# Altium project Project_2.PrjPCB
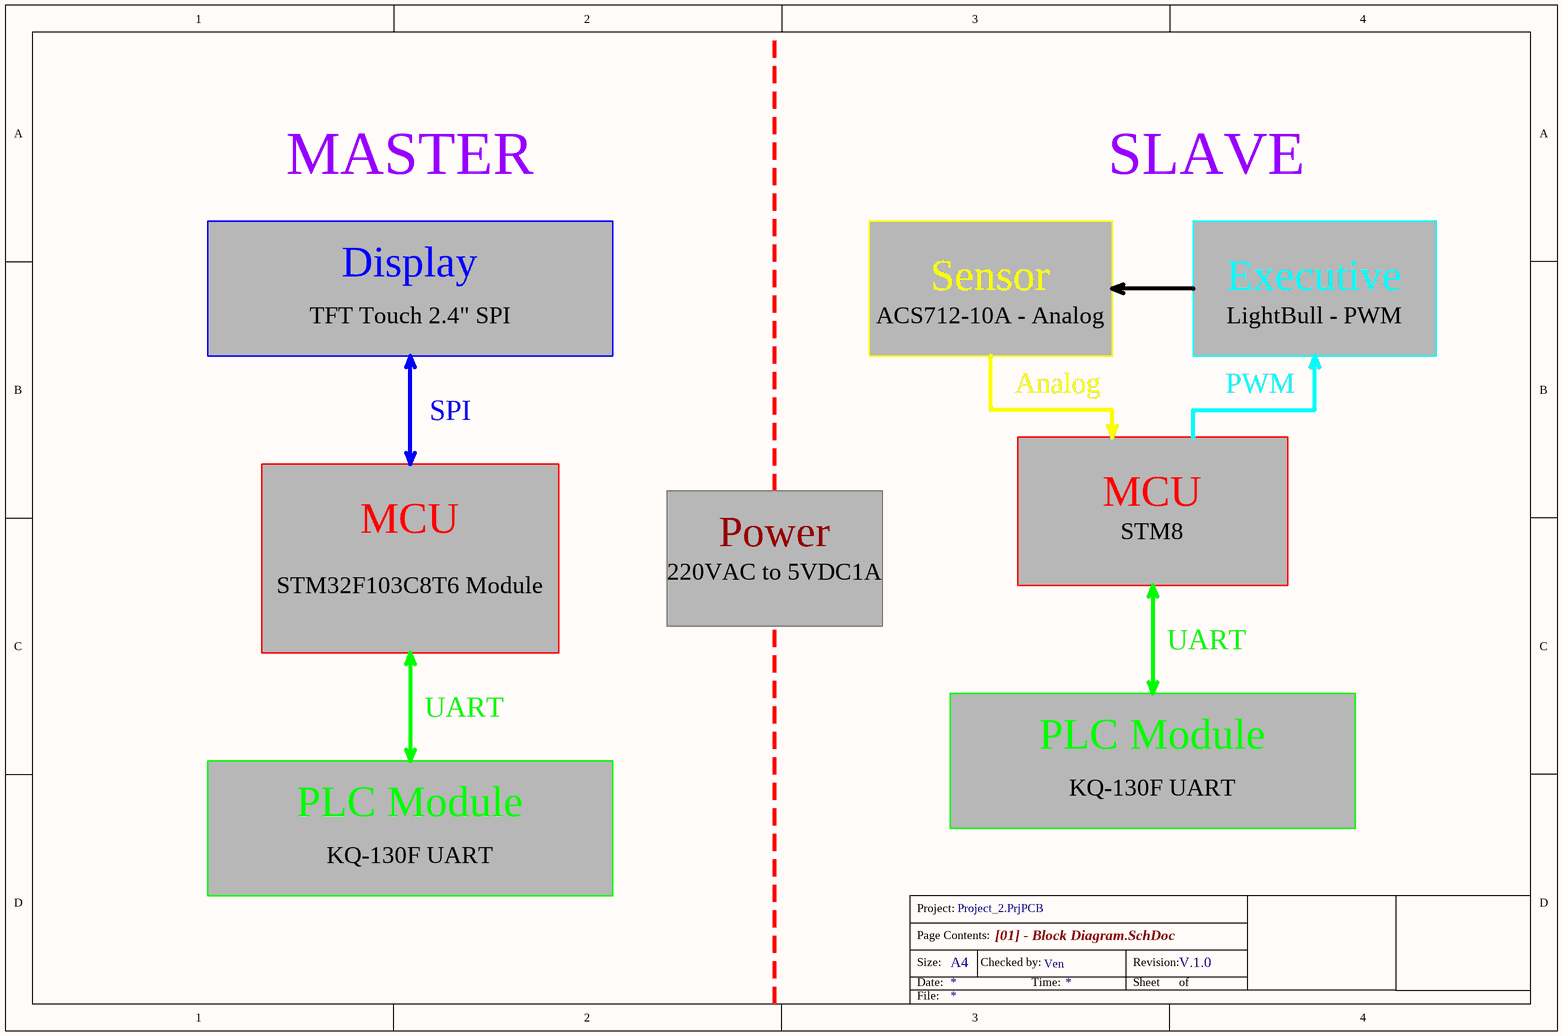
[diagram p0: [01] - Block Diagram.SchDoc]
10 sheets, 121 parts. Net scope: hierarchical (ports join the sheet entries above them; power ports are global).
Board files: Project_2_Master_PCB.PcbDoc, Project_2_Slave_PCB.PcbDoc, Project_2_Master_PCB_V1_1.PcbDoc, Project_2_Slave_PCB_V1_1.PcbDoc, Project_2_Slave_PCB_V1_2.PcbDoc
Sheets:
  [01] - Block Diagram.SchDoc
  [02] - Sheet Connector.SchDoc
    1 = [03] - Master_MCU.SchDoc
    3 = [05] - Master_Display.SchDoc
    5 = [07] - Slave_MCU.SchDoc
    8 = [10] - Slave_PLCModule.SchDoc
    7 = [09] - Slave_Sensor & Output.SchDoc
    2 = [04] - Master_Power.SchDoc
    6 = [08] - Slave_Power.SchDoc
    4 = [06] - Master_PLCModule.SchDoc

## Sheet [01] - Block Diagram.SchDoc: =ProjectName
size A4; CheckedBy: Ven; Author: Ven; CompanyName: HUST; Revision: V.1.0

### Notes on the sheet
- MASTER
- SLAVE
- Display
- TFT Touch 2.4" SPI
- Sensor
- ACS712-10A - Analog
- Executive
- LightBull - PWM
- Analog
- PWM
- SPI
- MCU
- STM32F103C8T6 Module
- Power
- 220VAC to 5VDC1A
- STM8
- UART
- PLC Module
- KQ-130F UART
- Project:
- Page Contents:
- Size:
- Date:
- A4
- Checked by:
- Time:
- Revision:
- Sheet
- of
- File:

## Sheet [02] - Sheet Connector.SchDoc: =ProjectName
size A4; CheckedBy: Ven; Author: Ven; CompanyName: HUST; Revision: V.1.0
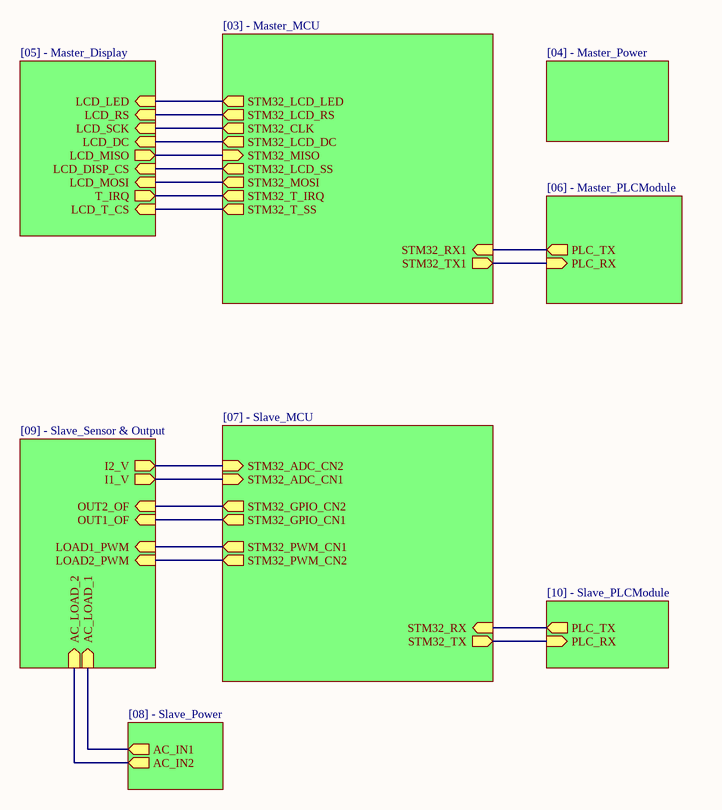
[diagram p1: [02] - Sheet Connector.SchDoc]

### Sub-sheets
1 = [03] - Master_MCU: STM32_LCD_LED (out), STM32_LCD_RS (out), STM32_CLK (out), STM32_LCD_DC (out), STM32_MISO (in), STM32_LCD_SS (out), STM32_MOSI (out), STM32_TX1 (out), STM32_T_IRQ (out), STM32_RX1 (in), STM32_T_SS (out)
2 = [04] - Master_Power: no entries
3 = [05] - Master_Display: LCD_MISO (out), T_IRQ (out), LCD_DC (in), LCD_SCK (in), LCD_LED (in), LCD_RS (in), LCD_MOSI (in), LCD_T_CS (in), LCD_DISP_CS (in)
4 = [06] - Master_PLCModule: PLC_TX (out), PLC_RX (in)
5 = [07] - Slave_MCU: STM32_ADC_CN1 (in), STM32_PWM_CN2 (out), STM32_ADC_CN2 (in), STM32_RX (in), STM32_GPIO_CN1 (out), STM32_GPIO_CN2 (out), STM32_TX (out), STM32_PWM_CN1 (out)
6 = [08] - Slave_Power: AC_IN2 (out), AC_IN1 (out)
7 = [09] - Slave_Sensor & Output: AC_LOAD_2 (in), I1_V (out), LOAD2_PWM (in), I2_V (out), AC_LOAD_1 (in), LOAD1_PWM (in), OUT2_OF (in), OUT1_OF (in)
8 = [10] - Slave_PLCModule: PLC_TX (out), PLC_RX (in)

### Nets
AC1: sheet 7/AC_LOAD_1, sheet 6/AC_IN1
AC2: sheet 7/AC_LOAD_2, sheet 6/AC_IN2
CS: sheet 1/STM32_LCD_SS, sheet 3/LCD_DISP_CS
DC: sheet 1/STM32_LCD_DC, sheet 3/LCD_DC
LED: sheet 1/STM32_LCD_LED, sheet 3/LCD_LED
MISO: sheet 1/STM32_MISO, sheet 3/LCD_MISO
MOSI: sheet 1/STM32_MOSI, sheet 3/LCD_MOSI
RS: sheet 1/STM32_LCD_RS, sheet 3/LCD_RS
SCK: sheet 1/STM32_CLK, sheet 3/LCD_SCK
T_CS: sheet 1/STM32_T_SS, sheet 3/LCD_T_CS
T_IQR: sheet 1/STM32_T_IRQ, sheet 3/T_IRQ
NetIC5_7: sheet 5/STM32_ADC_CN1, sheet 7/I1_V
NetIC6_7: sheet 5/STM32_ADC_CN2, sheet 7/I2_V
NetJP3_4: sheet 1/STM32_TX1, sheet 4/PLC_RX
NetJP3_5: sheet 1/STM32_RX1, sheet 4/PLC_TX
NetJP4_4: sheet 5/STM32_TX, sheet 8/PLC_RX
NetJP4_5: sheet 5/STM32_RX, sheet 8/PLC_TX
NetR20_2: sheet 5/STM32_PWM_CN1, sheet 7/LOAD1_PWM
NetR21_2: sheet 5/STM32_GPIO_CN1, sheet 7/OUT1_OF
NetR24_2: sheet 5/STM32_GPIO_CN2, sheet 7/OUT2_OF
NetR28_2: sheet 5/STM32_PWM_CN2, sheet 7/LOAD2_PWM

### Notes on the sheet
- Project:
- Page Contents:
- Size:
- Date:
- A4
- Checked by:
- Time:
- Revision:
- Sheet
- of
- File:

## Sheet [03] - Master_MCU.SchDoc: =ProjectName
size A4; CheckedBy: Ven; Author: Ven; CompanyName: HUST; Revision: V.1.0
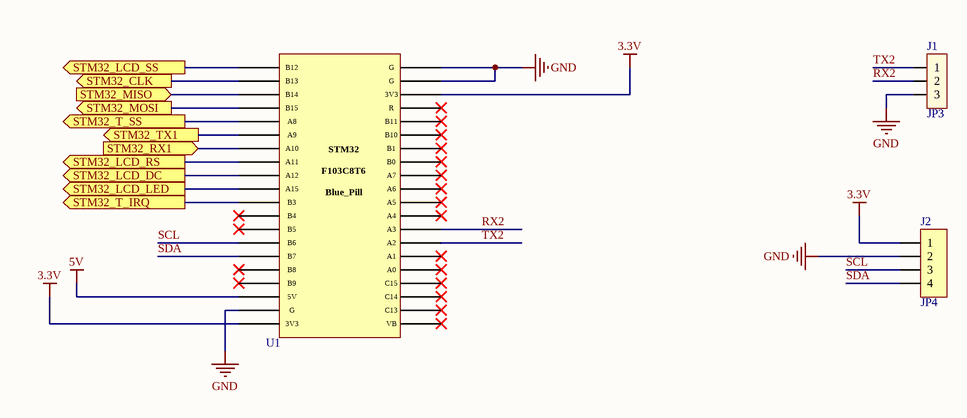
[diagram p2: [03] - Master_MCU.SchDoc]

### Parts
J1  JP3  [JP3]
J2  JP4  [J4-D1T]
U1  STM32 Bluepill  [Blue_Pill_Board]  (value not drawn)

### Ports
STM32_CLK (out), STM32_LCD_DC (out), STM32_LCD_LED (out), STM32_LCD_RS (out), STM32_LCD_SS (out), STM32_MISO (in), STM32_MOSI (out), STM32_RX1 (in), STM32_T_IRQ (out), STM32_T_SS (out), STM32_TX1 (out)

### Nets
3.3V: J2.1 U1.20(3V3) U1.23(3V3)
5V: U1.18(5V)
GND: J1.3 J2.2 U1.19(G) U1.21(G) U1.22(G)
CS: U1.1(B12) ; port STM32_LCD_SS
DC: U1.9(A12) ; port STM32_LCD_DC
LED: U1.10(A15) ; port STM32_LCD_LED
MISO: U1.3(B14) ; port STM32_MISO
MOSI: U1.4(B15) ; port STM32_MOSI
RS: U1.8(A11) ; port STM32_LCD_RS
RX2: J1.2 U1.33(A3)
SCK: U1.2(B13) ; port STM32_CLK
SCL: J2.3 U1.14(B6)
SDA: J2.4 U1.15(B7)
T_CS: U1.5(A8) ; port STM32_T_SS
T_IQR: U1.11(B3) ; port STM32_T_IRQ
TX2: J1.1 U1.34(A2)
NetJP3_4: U1.6(A9) ; port STM32_TX1
NetJP3_5: U1.7(A10) ; port STM32_RX1

Not connected (* = marked no-connect by the designer): U1 12(B4)* 13(B5)* 16(B8)* 17(B9)* 24(R)* 25(B11)* 26(B10)* 27(B1)* 28(B0)* 29(A7)* 30(A6)* 31(A5)* 32(A4)* 35(A1)* 36(A0)* 37(C15)* 38(C14)* 39(C13)* 40(VB)*

### Notes on the sheet
- Project:
- Page Contents:
- Size:
- Date:
- A4
- Checked by:
- Time:
- Revision:
- Sheet
- of
- File:
- (in symbol STM32 Bluepill) / STM32 / F103C8T6 / Blue_Pill

### Library data of the parts
J1 = JP3: UART2; Value: J3
J2 = JP4x1-2.0: I2C; Manufacturer: W¨¹rth Elektronik eiSos GmbH; partNo: 62000411821; ComponentLink1 Description: Manufacturer; ComponentLink2 Description: Datasheet; NoPins: 04; Created Date: 2 April 2013; ComponentLink1URL: http://www.we-online.com; ComponentLink2URL: http://katalog.we-online.de/em/datasheet/6200xx11821.pdf; Created by: Karrer Zheng
U1 = STM32 Bluepill: STM32 Bluepill Kit

## Sheet [05] - Master_Display.SchDoc: =ProjectName
size A4; CheckedBy: Ven; Author: Ven; CompanyName: HUST; Revision: V.1.0
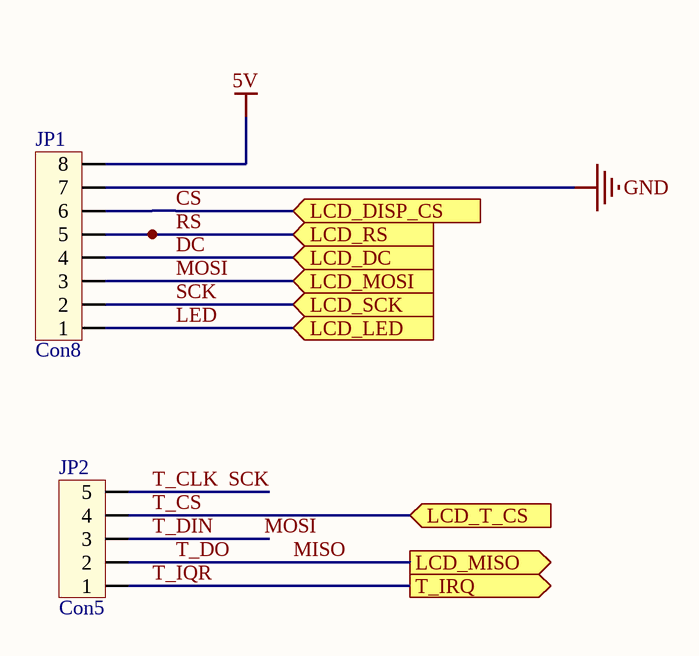
[diagram p3: [05] - Master_Display.SchDoc]

### Parts
JP1  Con8  [CON8]
JP2  Con5  [CON5]

### Ports
LCD_DC (in), LCD_DISP_CS (in), LCD_LED (in), LCD_MISO (out), LCD_MOSI (in), LCD_RS (in), LCD_SCK (in), LCD_T_CS (in), T_IRQ (out)

### Nets
5V: JP1.8
GND: JP1.7
CS: JP1.6 ; port LCD_DISP_CS
DC: JP1.4 ; port LCD_DC
LED: JP1.1 ; port LCD_LED
MISO: JP2.2 ; port LCD_MISO  [also labelled T_DO]
MOSI: JP1.3 JP2.3 ; port LCD_MOSI  [also labelled T_DIN]
RS: JP1.5 ; port LCD_RS
SCK: JP1.2 JP2.5 ; port LCD_SCK  [also labelled T_CLK]
T_CS: JP2.4 ; port LCD_T_CS
T_IQR: JP2.1 ; port T_IRQ

### Notes on the sheet
- Project:
- Page Contents:
- Size:
- Date:
- A4
- Checked by:
- Time:
- Revision:
- Sheet
- of
- File:

### Library data of the parts
JP1 = Con8: DISPLAY; Value: Connector 8
JP2 = Con5: TOUCH; Value: Connector 5

## Sheet [07] - Slave_MCU.SchDoc: =ProjectName
size A4; CheckedBy: Ven; Author: Ven; CompanyName: HUST; Revision: V.1.0
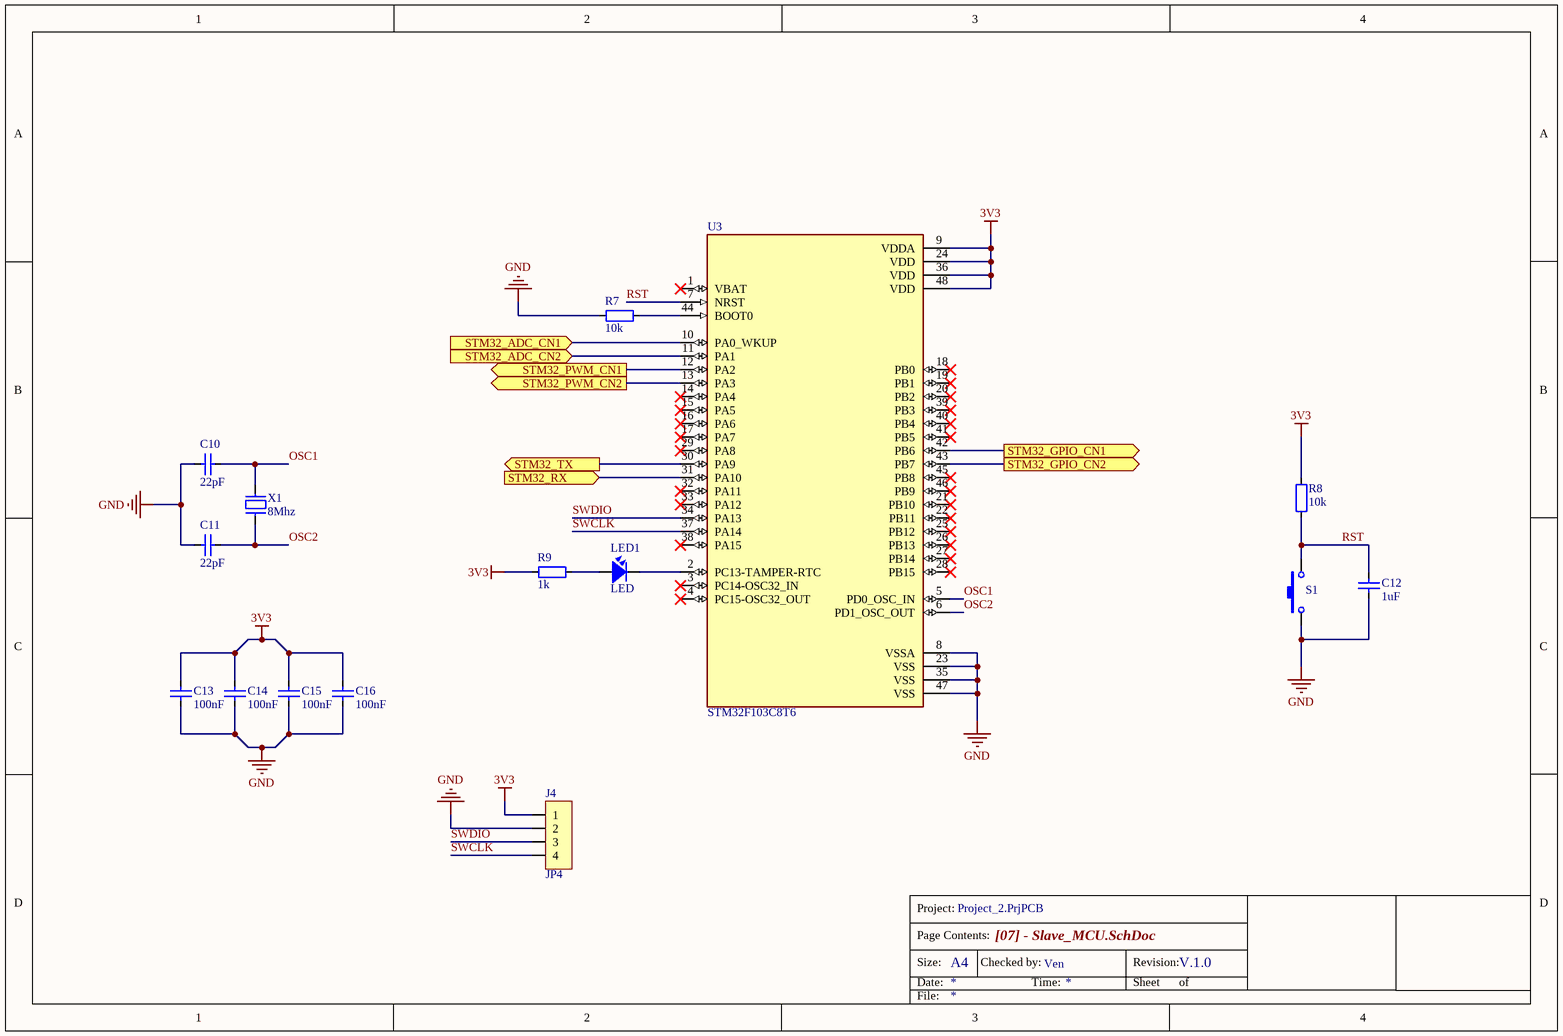
[diagram p4: [07] - Slave_MCU.SchDoc]

### Parts
C10  22pF  [CAP_0805]
C11  22pF  [CAP_0805]
C12  1uF  [CAP_0805]
C13  100nF  [CAP_0805]
C14  100nF  [CAP_0805]
C15  100nF  [CAP_0805]
C16  100nF  [CAP_0805]
J4  JP4  [JP4-C1T]
LED1  LED  [LED-0805-Blue]
R7  10k  [RES-SMD-0805]
R8  10k  [RES-SMD-0805]
R9  1k  [RES-SMD-0805]
S1  SW-SMD  [SW 3x2x4]  (value not drawn)
U3  STM32F103C8T6  [LQFP 48]
X1  8Mhz  [XTAL 5032 SMD]

### Ports
STM32_ADC_CN1 (in), STM32_ADC_CN2 (in), STM32_GPIO_CN1 (out), STM32_GPIO_CN2 (out), STM32_PWM_CN1 (out), STM32_PWM_CN2 (out), STM32_RX (in), STM32_TX (out)

### Nets
3V3: C13.2 C14.2 C15.2 C16.2 J4.1 R8.2 R9.2 U3.9(VDDA) U3.24(VDD) U3.36(VDD) U3.48(VDD)
GND: C10.2 C11.2 C12.1 C13.1 C14.1 C15.1 C16.1 J4.2 R7.2 S1.1 U3.8(VSSA) U3.23(VSS) U3.35(VSS) U3.47(VSS)
OSC1: C10.1 U3.5(PD0_OSC_IN) X1.2
OSC2: C11.1 U3.6(PD1_OSC_OUT) X1.1
RST: C12.2 R8.1 S1.2 U3.7(NRST)
SWCLK: J4.4 U3.37(PA14)
SWDIO: J4.3 U3.34(PA13)
NetIC5_7: U3.10(PA0_WKUP) ; port STM32_ADC_CN1
NetIC6_7: U3.11(PA1) ; port STM32_ADC_CN2
NetJP4_4: U3.30(PA9) ; port STM32_TX
NetJP4_5: U3.31(PA10) ; port STM32_RX
NetLED1_1: LED1.1 R9.1
NetLED1_2: LED1.2 U3.2(PC13-TAMPER-RTC)
NetR7_1: R7.1 U3.44(BOOT0)
NetR20_2: U3.12(PA2) ; port STM32_PWM_CN1
NetR21_2: U3.42(PB6) ; port STM32_GPIO_CN1
NetR24_2: U3.43(PB7) ; port STM32_GPIO_CN2
NetR28_2: U3.13(PA3) ; port STM32_PWM_CN2

Not connected (* = marked no-connect by the designer): U3 1(VBAT)* 3(PC14-OSC32_IN)* 4(PC15-OSC32_OUT)* 14(PA4)* 15(PA5)* 16(PA6)* 17(PA7)* 18(PB0)* 19(PB1)* 20(PB2)* 21(PB10)* 22(PB11)* 25(PB12)* 26(PB13)* 27(PB14)* 28(PB15)* 29(PA8)* 32(PA11)* 33(PA12)* 38(PA15)* 39(PB3)* 40(PB4)* 41(PB5)* 45(PB8)* 46(PB9)*

### Notes on the sheet
- Project:
- Page Contents:
- Size:
- Date:
- A4
- Checked by:
- Time:
- Revision:
- Sheet
- of
- File:

### Library data of the parts
C10-C16 = CapSMD: Capacitor; Value: 33p; Published: 8-Jun-2000; LatestRevisionDate: 17-Jul-2002; LatestRevisionNote: Re-released for DXP Platform.; PackageReference: RAD-0.3; Publisher: Altium Limited
J4 = JP4: WR-PHD 2.54 mm Angled Socket Header; Manufacturer: W¨¹rth Elektronik eiSos GmbH; partNo: 613004143121; ComponentLink1 Description: Manufacturer; ComponentLink2 Description: Datasheet; NoPins: 04; Created Date: 29 March 2013; ComponentLink1URL: http://www.we-online.com; ComponentLink2URL: http://katalog.we-online.de/em/datasheet/6130xx143121.pdf; Created by: Karrer Zheng
LED1 = LED: LED Single colour Green and Red; Value: LED 3 ly Single Colour
R7-R9 = Resistor - SMD: Resistor; Manufacturer: Generic Components; Class: Passive; Published: 08/06/2000; Publisher: Altium Hobart Technology Centre
S1 = SW-SMD: Switch; Published: 24-Mar-1999; LatestRevisionDate: 17-Jul-2002; LatestRevisionNote: Re-released for DXP Platform.; PackageReference: SPST-2; Publisher: Altium Limited
X1 = XT2: Crystal For all Crystal 2pin.; Value: 4Mhz

## Sheet [10] - Slave_PLCModule.SchDoc: =ProjectName
size A4; CheckedBy: Ven; Author: Ven; CompanyName: HUST; Revision: V.1.0
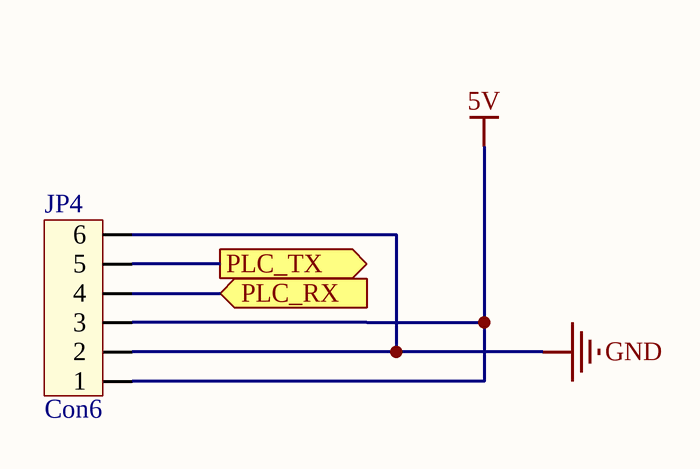
[diagram p5: [10] - Slave_PLCModule.SchDoc]

### Parts
JP4  Con6  [CON6]

### Ports
PLC_RX (in), PLC_TX (out)

### Nets
5V: JP4.1 JP4.3
GND: JP4.2 JP4.6
NetJP4_4: JP4.4 ; port PLC_RX
NetJP4_5: JP4.5 ; port PLC_TX

### Notes on the sheet
- Project:
- Page Contents:
- Size:
- Date:
- A4
- Checked by:
- Time:
- Revision:
- Sheet
- of
- File:

### Library data of the parts
JP4 = Con6: PLC module; Value: Connector 6

## Sheet [09] - Slave_Sensor & Output.SchDoc: =ProjectName
size A4; CheckedBy: DatNB; Author: Ven; CompanyName: Nacentech; Organization: IMET
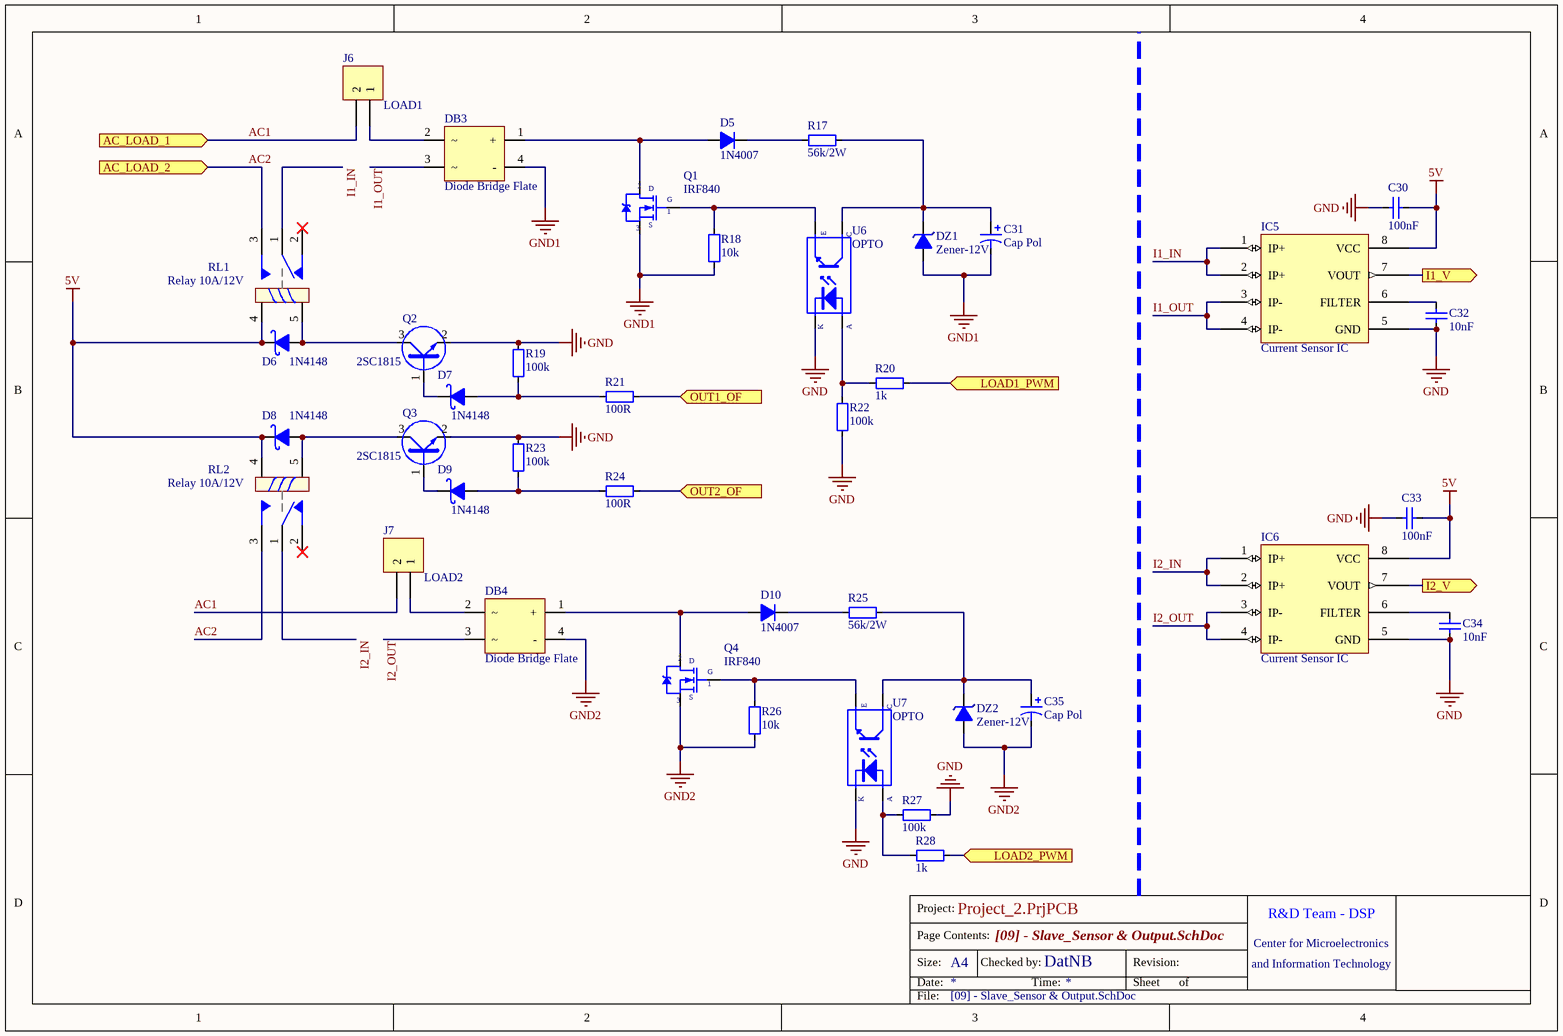
[diagram p6: [09] - Slave_Sensor & Output.SchDoc]

### Parts
C30  100nF  [CAP_0805]
C31  Cap Pol  [C5mm]
C32  10nF  [CAP_0805]
C33  100nF  [CAP_0805]
C34  10nF  [CAP_0805]
C35  Cap Pol  [C5mm]
D5  1N4007  [D2A]
D6  1N4148  [1N4148_SMD]
D7  1N4148  [1N4148_SMD]
D8  1N4148  [1N4148_SMD]
D9  1N4148  [1N4148_SMD]
D10  1N4007  [D2A]
DB3  Diode Bridge Flate  [DB207S]
DB4  Diode Bridge Flate  [DB207S]
DZ1  Zener-12V  [D1A]
DZ2  Zener-12V  [D1A]
IC5  Current Sensor IC  [SOIC-8]
IC6  Current Sensor IC  [SOIC-8]
J6  LOAD1  [KF2-5.08T]
J7  LOAD2  [KF2-5.08T]
Q1  IRF840  [QTO-220H3]
Q2  2SC1815  [SOT23D]
Q3  2SC1815  [SOT23D]
Q4  IRF840  [QTO-220H3]
R17  56k/2W  [RES-2W]
R18  10k  [RES-SMD-0805]
R19  100k  [RES-SMD-0805]
R20  1k  [RES-SMD-0805]
R21  100R  [RES-SMD-0805]
R22  100k  [RES-SMD-0805]
R23  100k  [RES-SMD-0805]
R24  100R  [RES-SMD-0805]
R25  56k/2W  [RES-2W]
R26  10k  [RES-SMD-0805]
R27  100k  [RES-SMD-0805]
R28  1k  [RES-SMD-0805]
RL1  Relay 10A/12V  [RL_SPDT_10A]
RL2  Relay 10A/12V  [RL_SPDT_10A]
U6  OPTO  [OPTO]
U7  OPTO  [OPTO]

### Ports
AC_LOAD_1 (in), AC_LOAD_2 (in), I1_V (out), I2_V (out), LOAD1_PWM (in), LOAD2_PWM (in), OUT1_OF (in), OUT2_OF (in)

### Nets
5V: C30.1 C33.1 D6.2(K) D8.2(K) IC5.8(VCC) IC6.8(VCC) RL1.4 RL2.4
GND: C30.2 C32.1 C33.2 C34.1 IC5.5(GND) IC6.5(GND) Q2.2(E) Q3.2(E) R19.2 R22.1 R23.2 R27.1 U6.K U7.K
GND1: C31.2 DB3.4(-) DZ1.1(A) Q1.3(S) R18.1
GND2: C35.2 DB4.4(-) DZ2.1(A) Q4.3(S) R26.1
AC1: J6.2 J7.2 ; port AC_LOAD_1
AC2: RL1.3 RL2.3 ; port AC_LOAD_2
I1_IN: IC5.1(IP+) IC5.2(IP+) RL1.1
I1_OUT: DB3.3 IC5.3(IP-) IC5.4(IP-)
I2_IN: IC6.1(IP+) IC6.2(IP+) RL2.1
I2_OUT: DB4.3 IC6.3(IP-) IC6.4(IP-)
NetC31_1: C31.1 DZ1.2(K) R17.2 U6.C
NetC32_2: C32.2 IC5.6(FILTER)
NetC34_2: C34.2 IC6.6(FILTER)
NetC35_1: C35.1 DZ2.2(K) R25.2 U7.C
NetD5_1: D5.1(A) DB3.1(+) Q1.2(D)
NetD5_2: D5.2(K) R17.1
NetD6_1: D6.1(A) Q2.3(C) RL1.5
NetD7_1: D7.1(A) R19.1 R21.1
NetD7_2: D7.2(K) Q2.1(B)
NetD8_1: D8.1(A) Q3.3(C) RL2.5
NetD9_1: D9.1(A) R23.1 R24.1
NetD9_2: D9.2(K) Q3.1(B)
NetD10_1: D10.1(A) DB4.1(+) Q4.2(D)
NetD10_2: D10.2(K) R25.1
NetDB3_2: DB3.2 J6.1
NetDB4_2: DB4.2 J7.1
NetIC5_7: IC5.7(VOUT) ; port I1_V
NetIC6_7: IC6.7(VOUT) ; port I2_V
NetQ1_1: Q1.1(G) R18.2 U6.E
NetQ4_1: Q4.1(G) R26.2 U7.E
NetR20_1: R20.1 R22.2 U6.A
NetR20_2: R20.2 ; port LOAD1_PWM
NetR21_2: R21.2 ; port OUT1_OF
NetR24_2: R24.2 ; port OUT2_OF
NetR27_2: R27.2 R28.1 U7.A
NetR28_2: R28.2 ; port LOAD2_PWM

Not connected (* = marked no-connect by the designer): RL1 2*; RL2 2*

### Notes on the sheet
- Project:
- R&D Team - DSP
- Page Contents:
- Size:
- Date:
- A4
- Checked by:
- Time:
- Revision:
- Sheet
- of
- Center for Microelectronics
- and Information Technology
- File:

### Library data of the parts
C30 C32-C34 = CapSMD: Capacitor; Value: 33p; Published: 8-Jun-2000; LatestRevisionDate: 17-Jul-2002; LatestRevisionNote: Re-released for DXP Platform.; PackageReference: RAD-0.3; Publisher: Altium Limited
C31 C35 = Cap Pol: Polarized Capacitor (Axial); Published: 8-Jun-2000; LatestRevisionDate: 17-Jul-2002; LatestRevisionNote: Re-released for DXP Platform.; PackageReference: POLAR0.8; Publisher: Altium Limited
D5 D10 = D1A: Diode 1A; Value: 1N4007
D6-D9 = 1N5822: Schottky Rectifiers; Value: Diode c?m 1N5408
DB3 DB4 = Diode Bridge Flate: Diode Bridge
DZ1 DZ2 = Zener
IC5 IC6 = ACS712
J6 J7 = KF2: Manufacturer: Würth Elektronik eiSos GmbH; partNo: 691103110002; ComponentLink1 Description: Manufacturer; ComponentLink2 Description: Datasheet; NoPins: 2; Created Date: 29 October 2013; ComponentLink1URL: http://www.we-online.com; ComponentLink2URL: http://katalog.we-online.de/em/datasheet/6911031100xx.pdf; Created by: Karrer Zheng
Q1 Q4 = IRF840: MOSFET N - CHANNEL 500V - 0.75 - 8A - TO-220; Value: IRF840
Q2 Q3 = 2SC1815: NPN 600mW, ECB; Value: C1815
R17 R18 R25 R26 = Resistor - DIP: Value: R1/4W - 1K
R19-R24 R27 R28 = Resistor - SMD: as R7 on sheet [07] - Slave_MCU; Published: 08/06/2000; Publisher: Altium Hobart Technology Centre
RL1 RL2 = Relay 1: Relay SPDT,10A - 12VDC 5 Pin; Value: Relay SPDT, 10A, 12V
U6 U7 = OPTO: Single Opto; pin to pad: A>1 C>4 E>3 K>2; Value: TLP5211

## Sheet [04] - Master_Power.SchDoc: =ProjectName
size A4; CheckedBy: DatNB; Author: Ven; CompanyName: Nacentech; Organization: IMET
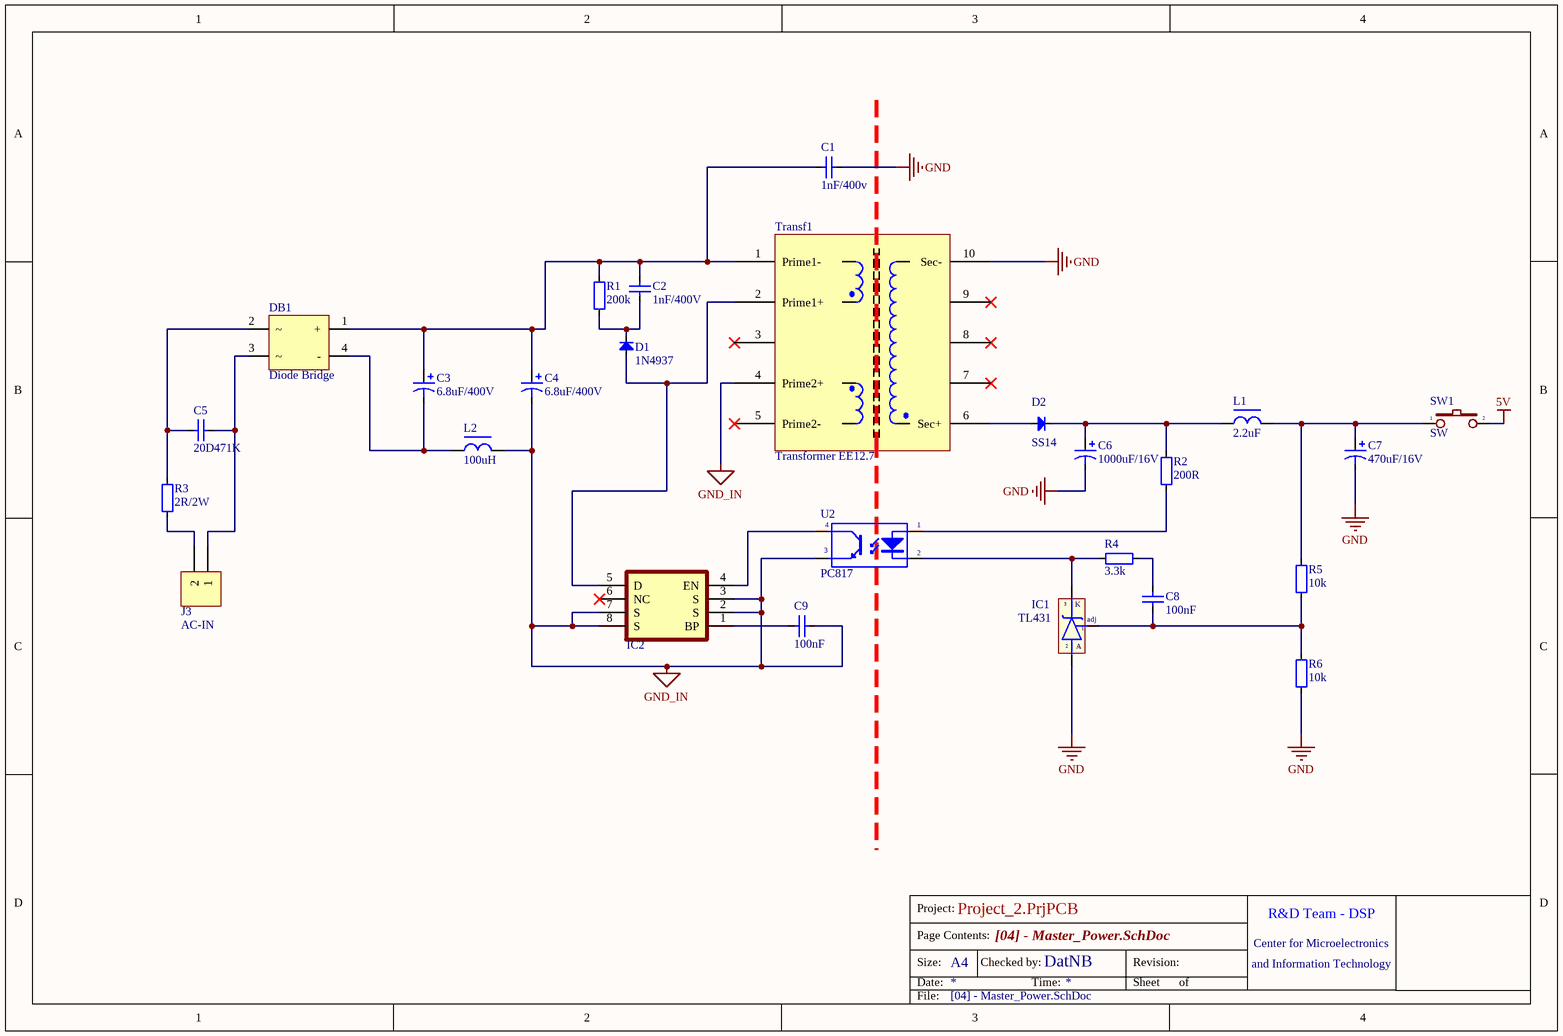
[diagram p7: [04] - Master_Power.SchDoc]

### Parts
C1  1nF/400v  [103/2KV]
C2  1nF/400V  [103/2KV]
C3  6.8uF/400V  [C8mm]
C4  6.8uF/400V  [C8mm]
C5  20D471K  [103/2KV]
C6  1000uF/16V  [C8mm]
C7  470uF/16V  [C8mm]
C8  100nF  [CAP_0805]
C9  100nF  [CAP_0805]
D1  1N4937  [DIO-1AN]
D2  SS14  [DO-214AC(SMA)]
DB1  Diode Bridge  [DB207S]
IC1  TL431  [qto-92]
IC2  TNY264  [DIP8]  (value not drawn)
J3  AC-IN  [KF2-5.08]
L1  2.2uF  [L-SMD-M-7.3x4.5]
L2  100uH  [L-DIP-M-9.5x6]
R1  200k  [RES-1/4WD]
R2  200R  [RES-SMD-0805]
R3  2R/2W  [RES-1WD]
R4  3.3k  [RES-SMD-0805]
R5  10k  [RES-SMD-0805]
R6  10k  [RES-SMD-0805]
SW1  SW  [SW2]
Transf1  Transformer EE12.7  [Transformer EE12.7]
U2  PC817  [DIP4/W0.3]

### Nets
5V: SW1.2
GND: C1.1 C6.2 C7.2 IC1.2(A) R6.2 Transf1.10(Sec-)
GND_IN: C4.2 C9.1 IC2.2(S) IC2.3(S) IC2.7(S) IC2.8(S) L2.2 Transf1.4(Prime2+) U2.3(E)
NetC1_2: C1.2 C2.1 C3.1 C4.1 DB1.1(+) R1.2 Transf1.1(Prime1-)
NetC2_2: C2.2 D1.2(K) R1.1
NetC3_2: C3.2 DB1.4(-) L2.1
NetC5_1: C5.1 DB1.3 J3.1
NetC5_2: C5.2 DB1.2 R3.1
NetC6_1: C6.1 D2.2(K) L1.1 R2.1
NetC7_1: C7.1 L1.2 R5.1 SW1.1
NetC8_1: C8.1 IC1.1(adj) R5.2 R6.1
NetC8_2: C8.2 R4.2
NetC9_2: C9.2 IC2.1(BP)
NetD1_1: D1.1(A) IC2.5(D) Transf1.2(Prime1+)
NetD2_1: D2.1(A) Transf1.6(Sec+)
NetIC1_3: IC1.3(K) R4.1 U2.2(K)
NetIC2_4: IC2.4(EN) U2.4(C)
NetJ3_2: J3.2 R3.2
NetR2_2: R2.2 U2.1(A)

Not connected (* = marked no-connect by the designer): IC2 6(NC)*; Transf1 3* 5(Prime2-)* 7* 8* 9*

### Notes on the sheet
- Project:
- R&D Team - DSP
- Page Contents:
- Size:
- Date:
- A4
- Checked by:
- Time:
- Revision:
- Sheet
- of
- Center for Microelectronics
- and Information Technology
- File:

### Library data of the parts
C1 C2 = Cap2KV: CAP CERAMIC; Published: 8-Jun-2000; LatestRevisionDate: 17-Jul-2002; LatestRevisionNote: Re-released for DXP Platform.; PackageReference: RAD-0.3; Publisher: Altium Limited
C3 C4 C6 C7 = Cap Pol: Polarized Capacitor (Axial); Published: 8-Jun-2000; LatestRevisionDate: 17-Jul-2002; LatestRevisionNote: Re-released for DXP Platform.; PackageReference: POLAR0.8; Publisher: Altium Limited
C5 = Cap2KV: Varistor; Published: 8-Jun-2000; LatestRevisionDate: 17-Jul-2002; LatestRevisionNote: Re-released for DXP Platform.; PackageReference: RAD-0.3; Publisher: Altium Limited
C8 C9 = CapSMD: Capacitor; Value: 33p; Published: 8-Jun-2000; LatestRevisionDate: 17-Jul-2002; LatestRevisionNote: Re-released for DXP Platform.; PackageReference: RAD-0.3; Publisher: Altium Limited
D1 = Diode SMD: Diode Schottky / 1N4937; Code - JEDEC: DO-214-AB; Value: 1N5007; Published: 8-Jun-2000; Revision: July-2002: Re-released for DXP Platform.; Publisher: Altium Limited
D2 = Diode SMD: Diode Schottky / 1N5819; Code - JEDEC: DO-214-AB; Value: 1N5007; Published: 8-Jun-2000; Revision: July-2002: Re-released for DXP Platform.; Publisher: Altium Limited
DB1 = Diode Bridge Flate
IC1 = TL431: Programmable Shunt Regulator; Value: TL431
IC2 = TNY264: Enhanced, Energy Efficient, Low Power Off-line Switcher
J3 = KF2: as J6 on sheet [09] - Slave_Sensor & Output; Created Date: 29 October 2013; ComponentLink1URL: http://www.we-online.com; ComponentLink2URL: http://katalog.we-online.de/em/datasheet/6911031100xx.pdf; Created by: Karrer Zheng
L1 L2 = L-DIP-1: Inductor; Value: 150 mH
R1-R6 = Resistor - SMD: as R7 on sheet [07] - Slave_MCU; Published: 08/06/2000; Publisher: Altium Hobart Technology Centre
SW1 = SW2: Switch button 2 pin; Value: SW chip 2 pin
Transf1 = Tranformer EE16
U2 = PC817: Single Opto; Value: PC817

## Sheet [08] - Slave_Power.SchDoc: =ProjectName
size A4; CheckedBy: DatNB; Author: Ven; CompanyName: Nacentech; Organization: IMET
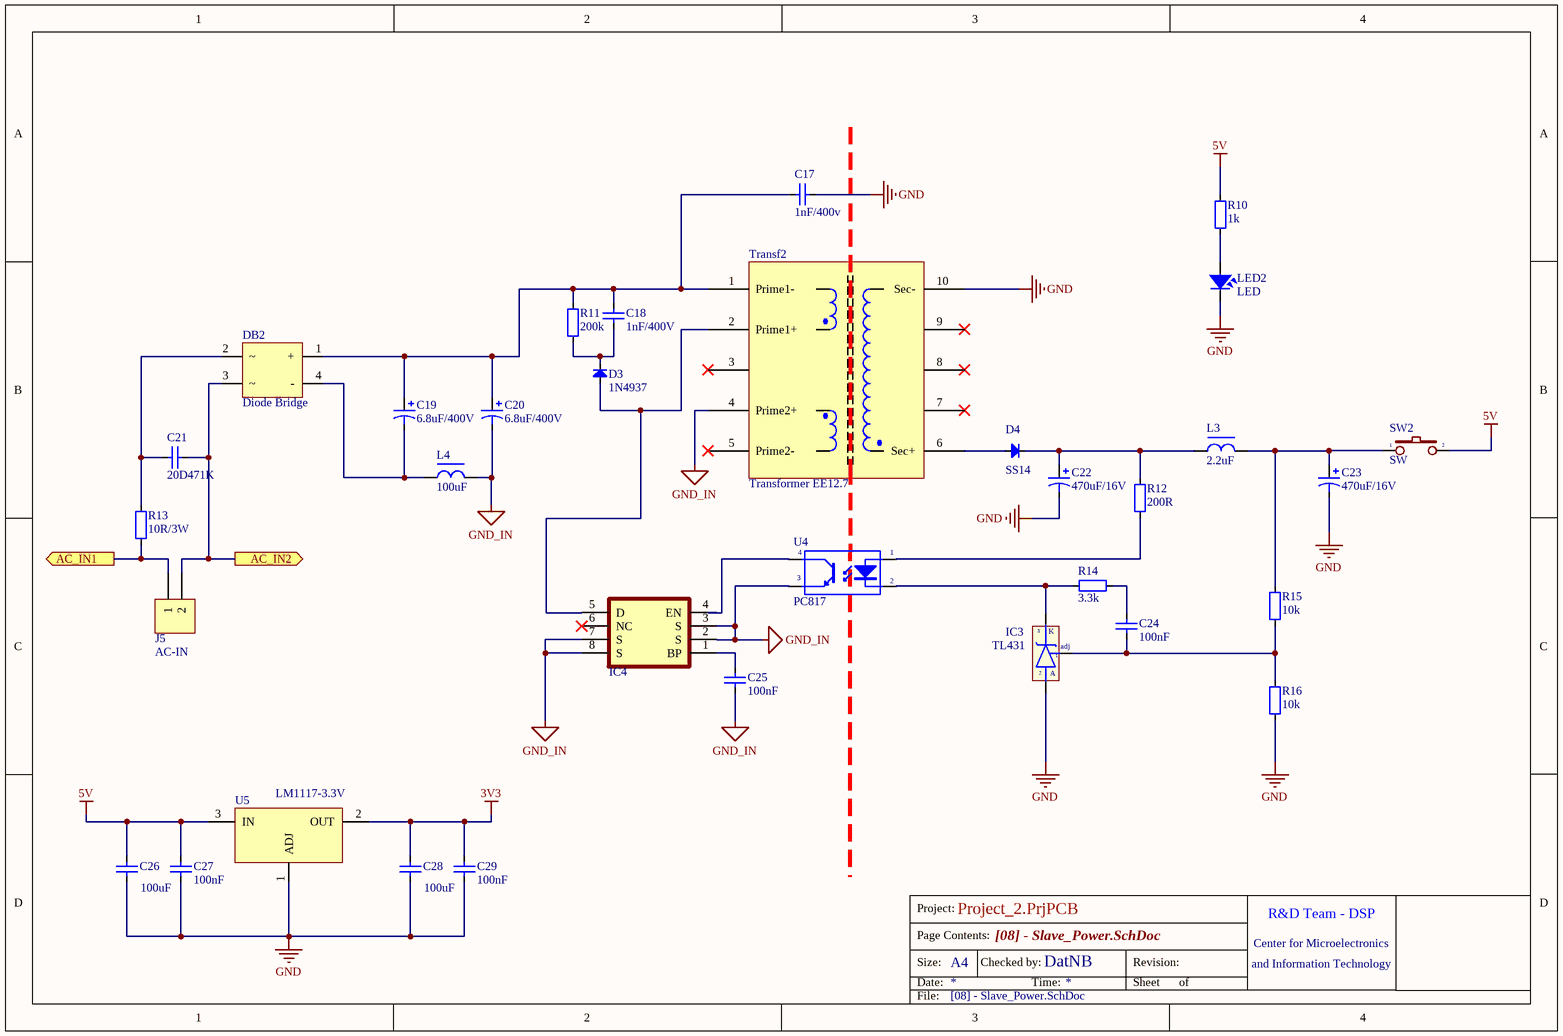
[diagram p8: [08] - Slave_Power.SchDoc]

### Parts
C17  1nF/400v  [103/2KV]
C18  1nF/400V  [103/2KV]
C19  6.8uF/400V  [C8mm]
C20  6.8uF/400V  [C8mm]
C21  20D471K  [103/2KV]
C22  470uF/16V  [C8mm]
C23  470uF/16V  [C8mm]
C24  100nF  [CAP_0805]
C25  100nF  [CAP_0805]
C26  100uF  [CAP_3216]
C27  100nF  [CAP_0805]
C28  100uF  [CAP_3216]
C29  100nF  [CAP_0805]
D3  1N4937  [DIO-1AN]
D4  SS14  [DO-214AC(SMA)]
DB2  Diode Bridge  [DB207S]
IC3  TL431  [qto-92]
IC4  TNY267  [DIP8]  (value not drawn)
J5  AC-IN  [KF2-5.08]
L3  2.2uF  [L-SMD-M-7.3x4.5]
L4  100uF  [L-DIP-M-9.5x6]
LED2  LED  [LED-0805-Red]
R10  1k  [RES-SMD-0805]
R11  200k  [RES-1/4WD]
R12  200R  [RES-SMD-0805]
R13  10R/3W  [RES-1WD]
R14  3.3k  [RES-SMD-0805]
R15  10k  [RES-SMD-0805]
R16  10k  [RES-SMD-0805]
SW2  SW  [SW2]
Transf2  Transformer EE12.7  [Transformer EE12.7]
U4  PC817  [DIP4/W0.3]
U5  LM1117-3.3V  [LM1117-SOP]

### Ports
AC_IN1 (out), AC_IN2 (out)

### Nets
3V3: C28.2 C29.2 U5.2(OUT)
5V: C26.2 C27.2 R10.2 SW2.2 U5.3(IN)
GND: C17.1 C22.2 C23.2 C26.1 C27.1 C28.1 C29.1 IC3.2(A) LED2.2 R16.2 Transf2.10(Sec-) U5.1(ADJ)
GND_IN: C20.2 C25.1 IC4.2(S) IC4.3(S) IC4.7(S) IC4.8(S) L4.2 Transf2.4(Prime2+) U4.3(E)
AC1: J5.1 R13.2 ; port AC_IN1
AC2: C21.1 DB2.3 J5.2 ; port AC_IN2
NetC17_2: C17.2 C18.1 C19.1 C20.1 DB2.1(+) R11.2 Transf2.1(Prime1-)
NetC18_2: C18.2 D3.2(K) R11.1
NetC19_2: C19.2 DB2.4(-) L4.1
NetC21_2: C21.2 DB2.2 R13.1
NetC22_1: C22.1 D4.2(K) L3.1 R12.1
NetC23_1: C23.1 L3.2 R15.1 SW2.1
NetC24_1: C24.1 IC3.1(adj) R15.2 R16.1
NetC24_2: C24.2 R14.2
NetC25_2: C25.2 IC4.1(BP)
NetD3_1: D3.1(A) IC4.5(D) Transf2.2(Prime1+)
NetD4_1: D4.1(A) Transf2.6(Sec+)
NetIC3_3: IC3.3(K) R14.1 U4.2(K)
NetIC4_4: IC4.4(EN) U4.4(C)
NetLED2_1: LED2.1 R10.1
NetR12_2: R12.2 U4.1(A)

Not connected (* = marked no-connect by the designer): IC4 6(NC)*; Transf2 3* 5(Prime2-)* 7* 8* 9*

### Notes on the sheet
- Project:
- R&D Team - DSP
- Page Contents:
- Size:
- Date:
- A4
- Checked by:
- Time:
- Revision:
- Sheet
- of
- Center for Microelectronics
- and Information Technology
- File:

### Library data of the parts
C17 C18 = Cap2KV: CAP CERAMIC; Published: 8-Jun-2000; LatestRevisionDate: 17-Jul-2002; LatestRevisionNote: Re-released for DXP Platform.; PackageReference: RAD-0.3; Publisher: Altium Limited
C19 C20 C22 C23 = Cap Pol: Polarized Capacitor (Axial); Published: 8-Jun-2000; LatestRevisionDate: 17-Jul-2002; LatestRevisionNote: Re-released for DXP Platform.; PackageReference: POLAR0.8; Publisher: Altium Limited
C21 = Cap2KV: Varistor; Published: 8-Jun-2000; LatestRevisionDate: 17-Jul-2002; LatestRevisionNote: Re-released for DXP Platform.; PackageReference: RAD-0.3; Publisher: Altium Limited
C24 C25 C27 C29 = CapSMD: Capacitor; Value: 33p; Published: 8-Jun-2000; LatestRevisionDate: 17-Jul-2002; LatestRevisionNote: Re-released for DXP Platform.; PackageReference: RAD-0.3; Publisher: Altium Limited
C26 C28 = CapSMD: Capacitor SMD; Value: 33p; Published: 8-Jun-2000; LatestRevisionDate: 17-Jul-2002; LatestRevisionNote: Re-released for DXP Platform.; PackageReference: RAD-0.3; Publisher: Altium Limited
D3 = Diode SMD: as D1 on sheet [04] - Master_Power; Published: 8-Jun-2000; Revision: July-2002: Re-released for DXP Platform.; Publisher: Altium Limited
D4 = Diode SMD: as D2 on sheet [04] - Master_Power; Published: 8-Jun-2000; Revision: July-2002: Re-released for DXP Platform.; Publisher: Altium Limited
DB2 = Diode Bridge Flate
IC3 = TL431: Programmable Shunt Regulator; Value: TL431
IC4 = TNY264: as IC2 on sheet [04] - Master_Power
J5 = KF2: as J6 on sheet [09] - Slave_Sensor & Output; Created Date: 29 October 2013; ComponentLink1URL: http://www.we-online.com; ComponentLink2URL: http://katalog.we-online.de/em/datasheet/6911031100xx.pdf; Created by: Karrer Zheng
L3 L4 = L-DIP-1: Inductor; Value: 150 mH
LED2 = LED: as LED1 on sheet [07] - Slave_MCU
R10-R16 = Resistor - SMD: as R7 on sheet [07] - Slave_MCU; Published: 08/06/2000; Publisher: Altium Hobart Technology Centre
SW2 = SW2: as SW1 on sheet [04] - Master_Power
Transf2 = Tranformer EE16
U4 = PC817: Single Opto; Value: PC817
U5 = LM1117-ADJ: 800mA Low-Dropout Linear Regulator; Creator: Nguyen Ba Bien; Website: http://group3i.net

## Sheet [06] - Master_PLCModule.SchDoc: =ProjectName
size A4; CheckedBy: Ven; Author: Ven; CompanyName: HUST; Revision: V.1.0
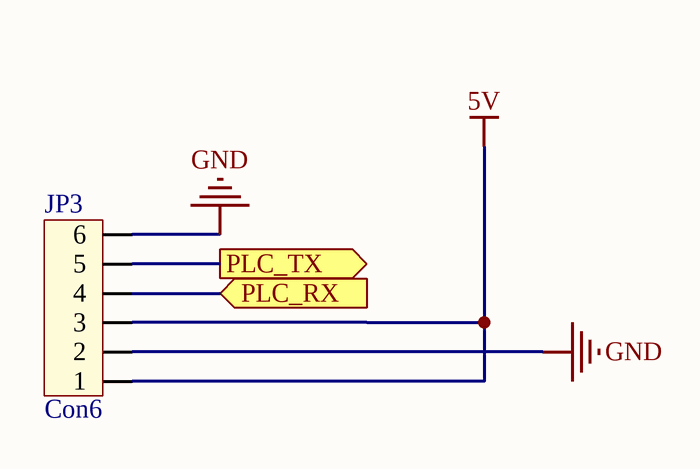
[diagram p9: [06] - Master_PLCModule.SchDoc]

### Parts
JP3  Con6  [CON6]

### Ports
PLC_RX (in), PLC_TX (out)

### Nets
5V: JP3.1 JP3.3
GND: JP3.2 JP3.6
NetJP3_4: JP3.4 ; port PLC_RX
NetJP3_5: JP3.5 ; port PLC_TX

### Notes on the sheet
- Project:
- Page Contents:
- Size:
- Date:
- A4
- Checked by:
- Time:
- Revision:
- Sheet
- of
- File:

### Library data of the parts
JP3 = Con6: PLC module; Value: Connector 6

## Nets that join several sheets
3V3: [07] - Slave_MCU (11 pins), [08] - Slave_Power (C28.2 C29.2 U5.2)
5V: [03] - Master_MCU (U1.18), [05] - Master_Display (JP1.8), [10] - Slave_PLCModule (JP4.1 JP4.3), [09] - Slave_Sensor & Output (8 pins), [04] - Master_Power (SW1.2), [08] - Slave_Power (5 pins), [06] - Master_PLCModule (JP3.1 JP3.3)
GND: [03] - Master_MCU (5 pins), [05] - Master_Display (JP1.7), [07] - Slave_MCU (14 pins), [10] - Slave_PLCModule (JP4.2 JP4.6), [09] - Slave_Sensor & Output (14 pins), [04] - Master_Power (6 pins), [08] - Slave_Power (12 pins), [06] - Master_PLCModule (JP3.2 JP3.6)
GND_IN: [04] - Master_Power (9 pins), [08] - Slave_Power (9 pins)
AC1: [09] - Slave_Sensor & Output (J6.2 J7.2), [08] - Slave_Power (J5.1 R13.2)
AC2: [09] - Slave_Sensor & Output (RL1.3 RL2.3), [08] - Slave_Power (C21.1 DB2.3 J5.2)
CS: [03] - Master_MCU (U1.1), [05] - Master_Display (JP1.6)
DC: [03] - Master_MCU (U1.9), [05] - Master_Display (JP1.4)
LED: [03] - Master_MCU (U1.10), [05] - Master_Display (JP1.1)
MISO: [03] - Master_MCU (U1.3), [05] - Master_Display (JP2.2)
MOSI: [03] - Master_MCU (U1.4), [05] - Master_Display (JP1.3 JP2.3)
NetIC5_7: [07] - Slave_MCU (U3.10), [09] - Slave_Sensor & Output (IC5.7)
NetIC6_7: [07] - Slave_MCU (U3.11), [09] - Slave_Sensor & Output (IC6.7)
NetJP3_4: [03] - Master_MCU (U1.6), [06] - Master_PLCModule (JP3.4)
NetJP3_5: [03] - Master_MCU (U1.7), [06] - Master_PLCModule (JP3.5)
NetJP4_4: [07] - Slave_MCU (U3.30), [10] - Slave_PLCModule (JP4.4)
NetJP4_5: [07] - Slave_MCU (U3.31), [10] - Slave_PLCModule (JP4.5)
NetR20_2: [07] - Slave_MCU (U3.12), [09] - Slave_Sensor & Output (R20.2)
NetR21_2: [07] - Slave_MCU (U3.42), [09] - Slave_Sensor & Output (R21.2)
NetR24_2: [07] - Slave_MCU (U3.43), [09] - Slave_Sensor & Output (R24.2)
NetR28_2: [07] - Slave_MCU (U3.13), [09] - Slave_Sensor & Output (R28.2)
RS: [03] - Master_MCU (U1.8), [05] - Master_Display (JP1.5)
SCK: [03] - Master_MCU (U1.2), [05] - Master_Display (JP1.2 JP2.5)
T_CS: [03] - Master_MCU (U1.5), [05] - Master_Display (JP2.4)
T_IQR: [03] - Master_MCU (U1.11), [05] - Master_Display (JP2.1)